# Altium schematic sheet PWR_TLV71318.SchDoc
size A3
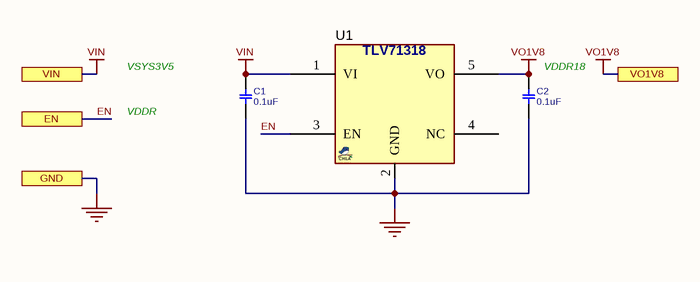
[diagram p0: PWR_TLV71318.SchDoc]

## Parts
C1  0.1uF  [C0402]
C2  0.1uF  [C0402]
U1  TLV71318  [SOT23_5]  (value not drawn)

## Ports
EN, GND, VIN, VO1V8

## Nets
GND: C1.1 C2.1 U1.2(GND) ; port GND
VIN: C1.2 U1.1(VI) ; port VIN
VO1V8: C2.2 U1.5(VO) ; port VO1V8
EN: U1.3(EN) ; port EN

Not connected (* = marked no-connect by the designer): U1 4(NC)

## Notes on the sheet
- VDDR
- VSYS3V5
- (near C2) VDDR18

## Library data of the parts
C1 C2 = CAP_SMD_MLCC: CAP, MLCC; PARAM: X5R, 10%; MANF_P#: GRM155R61E104; MANF: Murata; PARAM2: 25v; PRICE: 10,000:$0.006; ASSEMBLY: ASSEMBLY; VALUE: 0.1uF
U1 = VREG_TLV71318_SOT23: REG, Linear, LDO0.23V, 0.15A, 1.4~-5.5VIN, SOT23-5; PARAM2: 1.4~5.5VIN, 2.5V fixed, 65dB PSRR@1KHz; PARAM: LDO0.23V, 0.15A, 1.4~5.5V, -40~125oC; MANF: Texas Instruments; MANF_P#: TLV71318PDBV; PRICE: 0.1$; VALUE: TLV71318